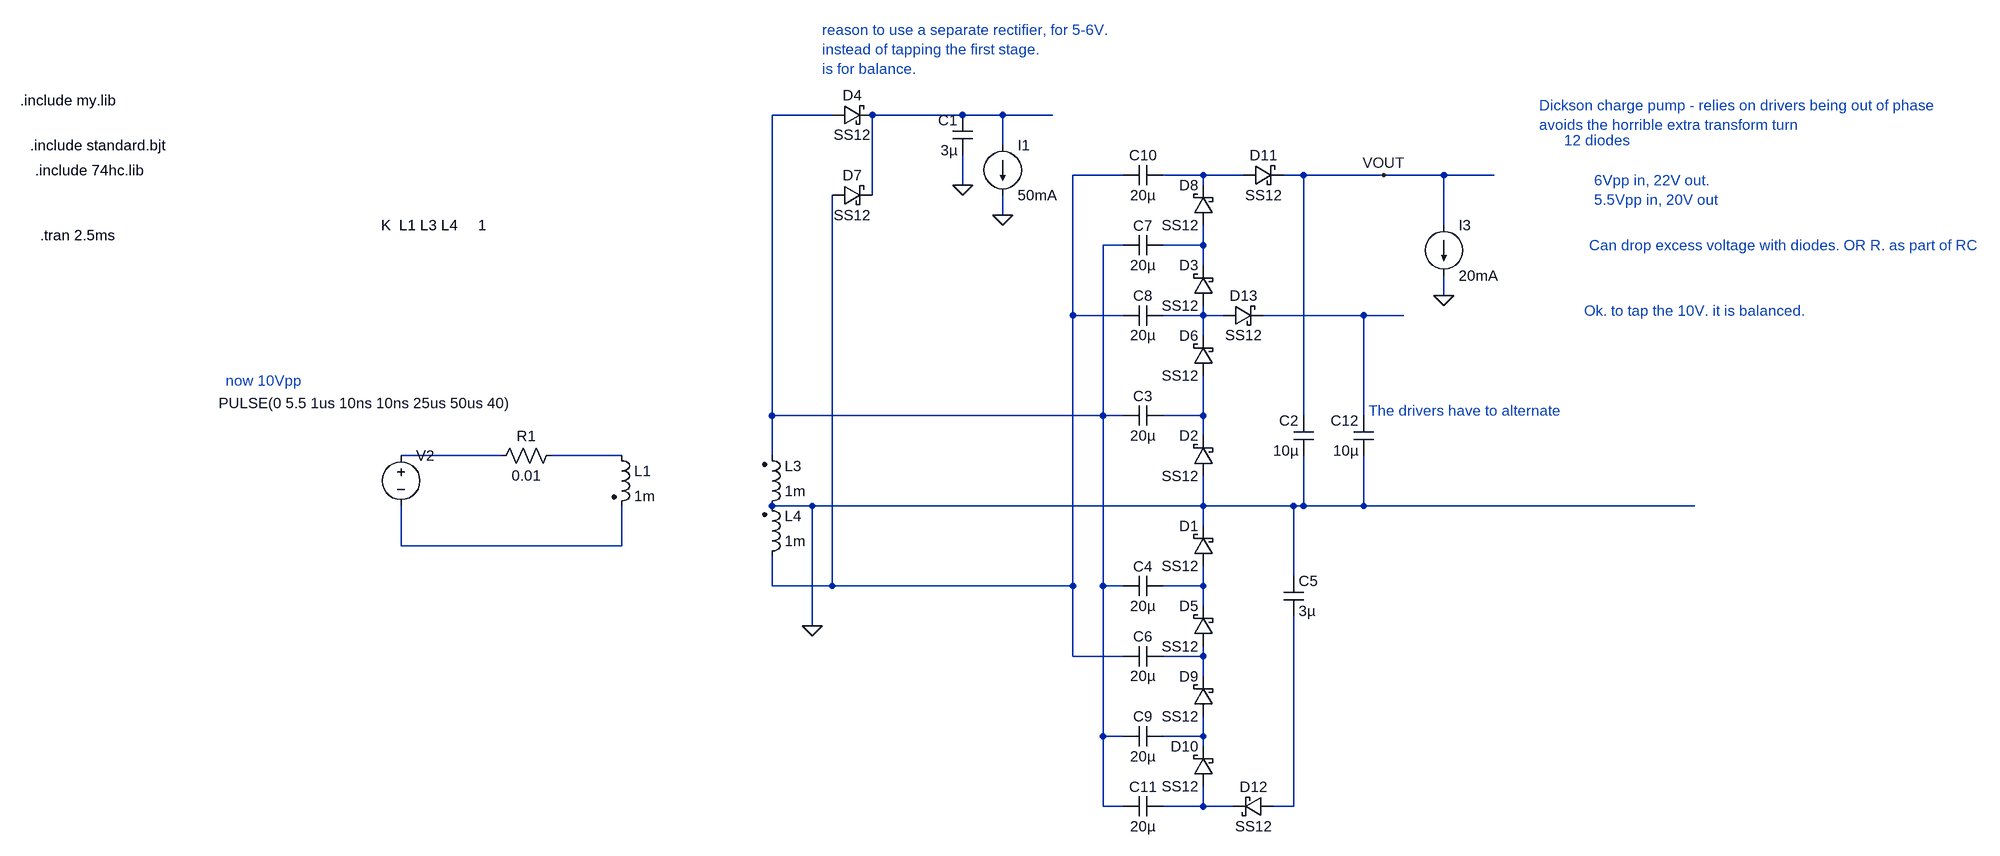
[diagram p0: schematic Draft101.asc]
Draft101.asc, the LTspice schematic file:
Version 4
SHEET 1 5720 1740
WIRE 1840 -672 1744 -672
WIRE 2048 -672 1904 -672
WIRE 2112 -672 2048 -672
WIRE 2192 -672 2112 -672
WIRE 2112 -624 2112 -672
WIRE 2304 -576 2224 -576
WIRE 2432 -576 2368 -576
WIRE 2496 -576 2432 -576
WIRE 2592 -576 2560 -576
WIRE 2720 -576 2592 -576
WIRE 2816 -576 2720 -576
WIRE 2896 -576 2816 -576
WIRE 2048 -560 2048 -608
WIRE 2432 -560 2432 -576
WIRE 1904 -544 1904 -672
WIRE 2112 -512 2112 -544
WIRE 2816 -496 2816 -576
WIRE 2304 -464 2272 -464
WIRE 2432 -464 2432 -496
WIRE 2432 -464 2368 -464
WIRE 2432 -432 2432 -464
WIRE 2816 -384 2816 -416
WIRE 2224 -352 2224 -576
WIRE 2304 -352 2224 -352
WIRE 2432 -352 2432 -368
WIRE 2432 -352 2368 -352
WIRE 2464 -352 2432 -352
WIRE 2688 -352 2528 -352
WIRE 2752 -352 2688 -352
WIRE 2432 -320 2432 -352
WIRE 1744 -192 1744 -672
WIRE 2272 -192 2272 -464
WIRE 2272 -192 1744 -192
WIRE 2304 -192 2272 -192
WIRE 2432 -192 2432 -256
WIRE 2432 -192 2368 -192
WIRE 2592 -192 2592 -576
WIRE 2688 -192 2688 -352
WIRE 2432 -160 2432 -192
WIRE 1312 -128 1152 -128
WIRE 1504 -128 1392 -128
WIRE 1744 -128 1744 -192
WIRE 1808 -48 1744 -48
WIRE 2432 -48 2432 -96
WIRE 2432 -48 1808 -48
WIRE 2576 -48 2432 -48
WIRE 2592 -48 2592 -128
WIRE 2592 -48 2576 -48
WIRE 2688 -48 2688 -128
WIRE 2688 -48 2592 -48
WIRE 3216 -48 2688 -48
WIRE 2432 -16 2432 -48
WIRE 1152 16 1152 -48
WIRE 1504 16 1504 -48
WIRE 1504 16 1152 16
WIRE 2576 64 2576 -48
WIRE 1744 80 1744 32
WIRE 1840 80 1840 -544
WIRE 1840 80 1744 80
WIRE 2224 80 2224 -352
WIRE 2224 80 1840 80
WIRE 2272 80 2272 -192
WIRE 2304 80 2272 80
WIRE 2432 80 2432 48
WIRE 2432 80 2368 80
WIRE 2432 112 2432 80
WIRE 1808 144 1808 -48
WIRE 2224 192 2224 80
WIRE 2304 192 2224 192
WIRE 2432 192 2432 176
WIRE 2432 192 2368 192
WIRE 2432 224 2432 192
WIRE 2272 320 2272 80
WIRE 2304 320 2272 320
WIRE 2432 320 2432 288
WIRE 2432 320 2368 320
WIRE 2432 336 2432 320
WIRE 2272 432 2272 320
WIRE 2304 432 2272 432
WIRE 2432 432 2432 400
WIRE 2432 432 2368 432
WIRE 2480 432 2432 432
WIRE 2576 432 2576 128
WIRE 2576 432 2544 432
FLAG 1808 144 0
FLAG 2720 -576 VOUT
FLAG 2816 -384 0
FLAG 2048 -560 0
FLAG 2112 -512 0
SYMBOL ind2 1728 -32 M180
WINDOW 0 36 80 Left 2
WINDOW 3 36 40 Left 2
SYMATTR InstName L3
SYMATTR Value 1m
SYMATTR Type ind
SYMBOL ind2 1728 48 M180
WINDOW 0 36 80 Left 2
WINDOW 3 36 40 Left 2
SYMATTR InstName L4
SYMATTR Value 1m
SYMATTR Type ind
SYMBOL ind2 1488 -144 R0
SYMATTR InstName L1
SYMATTR Value 1m
SYMATTR Type ind
SYMBOL voltage 1152 -144 R0
WINDOW 123 0 0 Left 0
WINDOW 39 0 0 Left 0
WINDOW 3 -291 -68 Left 2
SYMATTR Value PULSE(0 5.5 1us 10ns 10ns 25us 50us 40)
SYMATTR InstName V2
SYMBOL cap 2368 -208 R90
WINDOW 0 0 32 VBottom 2
WINDOW 3 32 32 VTop 2
SYMATTR InstName C3
SYMATTR Value 20µ
SYMBOL cap 2368 64 R90
WINDOW 0 0 32 VBottom 2
WINDOW 3 32 32 VTop 2
SYMATTR InstName C4
SYMATTR Value 20µ
SYMBOL cap 2560 64 R0
SYMATTR InstName C5
SYMATTR Value 3µ
SYMBOL current 2816 -496 R0
WINDOW 123 0 0 Left 0
WINDOW 39 0 0 Left 0
SYMATTR InstName I3
SYMATTR Value 20mA
SYMBOL schottky 2448 -96 R180
WINDOW 0 24 64 Left 2
WINDOW 3 24 0 Left 2
SYMATTR InstName D2
SYMATTR Value SS12
SYMATTR Description Diode
SYMATTR Type diode
SYMBOL schottky 2448 176 R180
WINDOW 0 24 64 Left 2
WINDOW 3 24 0 Left 2
SYMATTR InstName D5
SYMATTR Value SS12
SYMATTR Description Diode
SYMATTR Type diode
SYMBOL schottky 2448 48 R180
WINDOW 0 24 64 Left 2
WINDOW 3 24 0 Left 2
SYMATTR InstName D1
SYMATTR Value SS12
SYMATTR Description Diode
SYMATTR Type diode
SYMBOL schottky 2448 -256 R180
WINDOW 0 24 64 Left 2
WINDOW 3 24 0 Left 2
SYMATTR InstName D6
SYMATTR Value SS12
SYMATTR Description Diode
SYMATTR Type diode
SYMBOL cap 2608 -128 R180
WINDOW 0 24 56 Left 2
WINDOW 3 24 8 Left 2
SYMATTR InstName C2
SYMATTR Value 10µ
SYMBOL schottky 2448 -368 R180
WINDOW 0 24 64 Left 2
WINDOW 3 24 0 Left 2
SYMATTR InstName D3
SYMATTR Value SS12
SYMATTR Description Diode
SYMATTR Type diode
SYMBOL cap 2368 -368 R90
WINDOW 0 0 32 VBottom 2
WINDOW 3 32 32 VTop 2
SYMATTR InstName C8
SYMATTR Value 20µ
SYMBOL schottky 2448 288 R180
WINDOW 0 24 64 Left 2
WINDOW 3 24 0 Left 2
SYMATTR InstName D9
SYMATTR Value SS12
SYMATTR Description Diode
SYMATTR Type diode
SYMBOL res 1408 -144 R90
WINDOW 0 0 56 VBottom 2
WINDOW 3 32 56 VTop 2
SYMATTR InstName R1
SYMATTR Value 0.01
SYMBOL schottky 1840 -656 R270
WINDOW 0 32 32 VTop 2
WINDOW 3 0 32 VBottom 2
SYMATTR InstName D4
SYMATTR Value SS12
SYMATTR Description Diode
SYMATTR Type diode
SYMBOL schottky 1840 -528 R270
WINDOW 0 32 32 VTop 2
WINDOW 3 0 32 VBottom 2
SYMATTR InstName D7
SYMATTR Value SS12
SYMATTR Description Diode
SYMATTR Type diode
SYMBOL cap 2064 -608 R180
WINDOW 0 24 56 Left 2
WINDOW 3 24 8 Left 2
SYMATTR InstName C1
SYMATTR Value 3µ
SYMBOL current 2112 -624 R0
WINDOW 123 0 0 Left 0
WINDOW 39 0 0 Left 0
SYMATTR InstName I1
SYMATTR Value 50mA
SYMBOL cap 2368 176 R90
WINDOW 0 0 32 VBottom 2
WINDOW 3 32 32 VTop 2
SYMATTR InstName C6
SYMATTR Value 20µ
SYMBOL schottky 2448 -496 R180
WINDOW 0 24 64 Left 2
WINDOW 3 24 0 Left 2
SYMATTR InstName D8
SYMATTR Value SS12
SYMATTR Description Diode
SYMATTR Type diode
SYMBOL cap 2368 -480 R90
WINDOW 0 0 32 VBottom 2
WINDOW 3 32 32 VTop 2
SYMATTR InstName C7
SYMATTR Value 20µ
SYMBOL cap 2368 304 R90
WINDOW 0 0 32 VBottom 2
WINDOW 3 32 32 VTop 2
SYMATTR InstName C9
SYMATTR Value 20µ
SYMBOL schottky 2448 400 R180
WINDOW 0 24 64 Left 2
WINDOW 3 24 0 Left 2
SYMATTR InstName D10
SYMATTR Value SS12
SYMATTR Description Diode
SYMATTR Type diode
SYMBOL cap 2368 -592 R90
WINDOW 0 0 32 VBottom 2
WINDOW 3 32 32 VTop 2
SYMATTR InstName C10
SYMATTR Value 20µ
SYMBOL cap 2368 416 R90
WINDOW 0 0 32 VBottom 2
WINDOW 3 32 32 VTop 2
SYMATTR InstName C11
SYMATTR Value 20µ
SYMBOL schottky 2496 -560 R270
WINDOW 0 32 32 VTop 2
WINDOW 3 0 32 VBottom 2
SYMATTR InstName D11
SYMATTR Value SS12
SYMATTR Description Diode
SYMATTR Type diode
SYMBOL schottky 2544 416 R90
WINDOW 0 0 32 VBottom 2
WINDOW 3 32 32 VTop 2
SYMATTR InstName D12
SYMATTR Value SS12
SYMATTR Description Diode
SYMATTR Type diode
SYMBOL schottky 2464 -336 R270
WINDOW 0 32 32 VTop 2
WINDOW 3 0 32 VBottom 2
SYMATTR InstName D13
SYMATTR Value SS12
SYMATTR Description Diode
SYMATTR Type diode
SYMBOL cap 2704 -128 R180
WINDOW 0 24 56 Left 2
WINDOW 3 24 8 Left 2
SYMATTR InstName C12
SYMATTR Value 10µ
TEXT 576 -480 Left 2 !.tran 2.5ms
TEXT 1120 -496 Left 2 !K  L1 L3 L4     1
TEXT 560 -624 Left 2 !.include standard.bjt
TEXT 544 -696 Left 2 !.include my.lib
TEXT 568 -584 Left 2 !.include 74hc.lib
TEXT 872 -248 Left 2 ;now 10Vpp
TEXT 2696 -200 Left 2 ;The drivers have to alternate
TEXT 2968 -688 Left 2 ;Dickson charge pump - relies on drivers being out of phase\navoids the horrible extra transform turn
TEXT 3008 -632 Left 2 ;12 diodes
TEXT 3056 -568 Left 2 ;6Vpp in, 22V out.\n5.5Vpp in, 20V out
TEXT 3048 -464 Left 2 ;Can drop excess voltage with diodes. OR R. as part of RC
TEXT 1824 -808 Left 2 ;reason to use a separate rectifier, for 5-6V.\ninstead of tapping the first stage.\nis for balance.
TEXT 3040 -360 Left 2 ;Ok. to tap the 10V. it is balanced.

The netlist it stands for:
* Draft101.asc
L3 0 N001 1m
L4 N003 0 1m
L1 N010 N011 1m
V2 N009 N011 PULSE(0 5.5 1us 10ns 10ns 25us 50us 40)
C3 N008 N001 20µ
C4 N012 N001 20µ
C5 0 N016 3µ
I3 VOUT 0 20mA
D2 0 N008 SS12
D5 N013 N012 SS12
D1 N012 0 SS12
D6 N008 N006 SS12
C2 0 VOUT 10µ
D3 N006 N005 SS12
C8 N006 N003 20µ
D9 N014 N013 SS12
R1 N010 N009 0.01
D4 N001 N002 SS12
D7 N003 N002 SS12
C1 0 N002 3µ
I1 N002 0 50mA
C6 N013 N003 20µ
D8 N005 N004 SS12
C7 N005 N001 20µ
C9 N014 N001 20µ
D10 N015 N014 SS12
C10 N004 N003 20µ
C11 N015 N001 20µ
D11 N004 VOUT SS12
D12 N016 N015 SS12
D13 N006 N007 SS12
C12 0 N007 10µ
.model D D
.lib standard.dio
.tran 2.5ms
K  L1 L3 L4     1
.include standard.bjt
.include my.lib
.include 74hc.lib
* now 10Vpp
* The drivers have to alternate
* Dickson charge pump - relies on drivers being out of phase
* avoids the horrible extra transform turn
* 12 diodes
* 6Vpp in, 22V out.
* 5.5Vpp in, 20V out
* Can drop excess voltage with diodes. OR R. as part of RC
* reason to use a separate rectifier, for 5-6V.
* instead of tapping the first stage.
* is for balance.
* Ok. to tap the 10V. it is balanced.
.backanno
.end